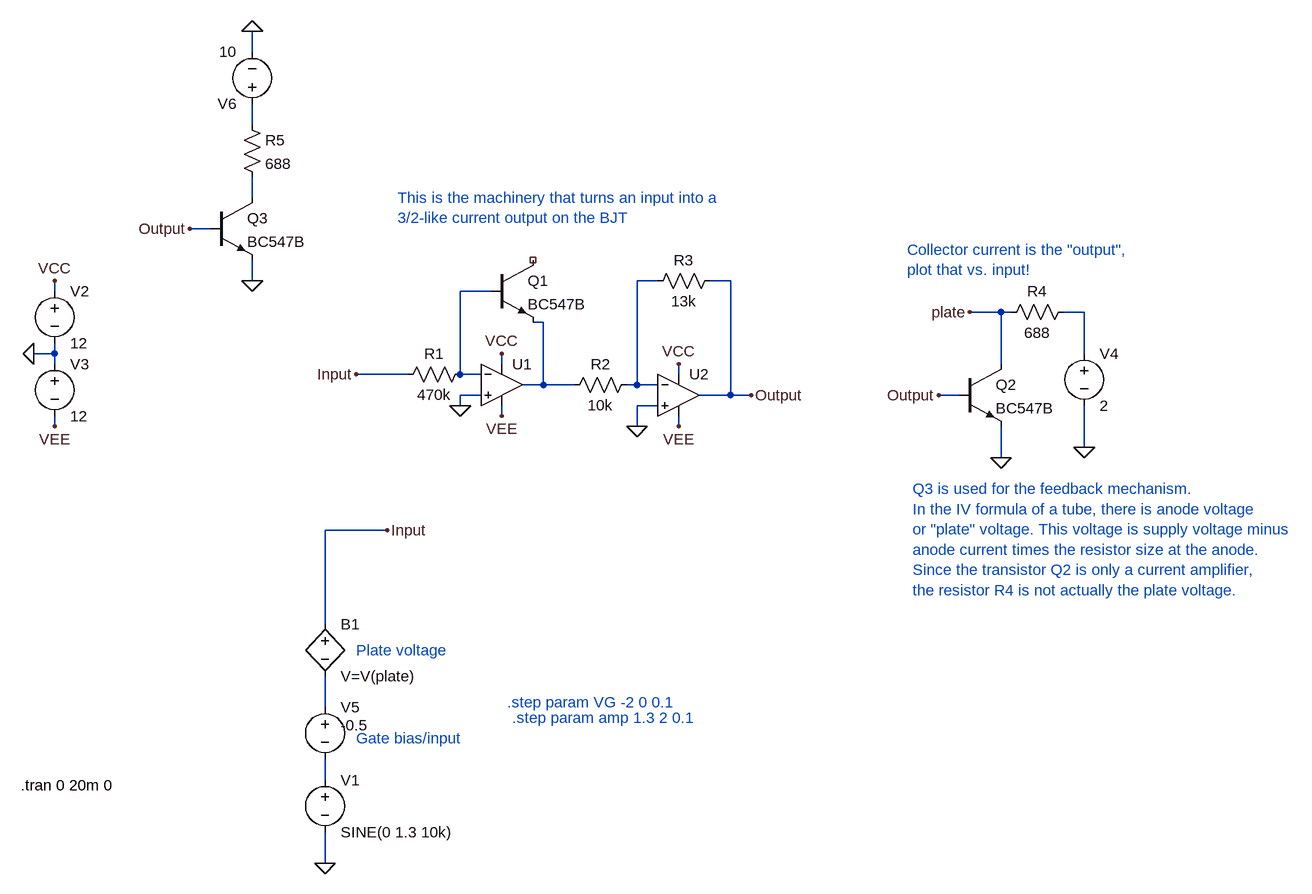
[diagram p0: schematic Amp_test.asc]
Amp_test.asc, the LTspice schematic file:
Version 4
SHEET 1 2184 900
WIRE -192 -368 -192 -400
WIRE -192 -256 -192 -288
WIRE -192 -144 -192 -176
WIRE -256 -96 -288 -96
WIRE -192 -16 -192 -48
WIRE 432 -16 400 -16
WIRE 544 -16 512 -16
WIRE -496 0 -496 -16
WIRE 176 0 128 0
WIRE 960 32 912 32
WIRE 976 32 960 32
WIRE 1088 32 1056 32
WIRE 256 48 240 48
WIRE -496 96 -496 80
WIRE -496 96 -528 96
WIRE 1088 96 1088 32
WIRE -496 112 -496 96
WIRE 192 112 192 96
WIRE 960 112 960 32
WIRE 48 128 -32 128
WIRE 128 128 128 0
WIRE 160 128 128 128
WIRE 464 128 464 112
WIRE 256 144 256 48
WIRE 256 144 224 144
WIRE 304 144 256 144
WIRE 400 144 400 -16
WIRE 400 144 384 144
WIRE 432 144 400 144
WIRE 160 160 128 160
WIRE 544 160 544 -16
WIRE 544 160 496 160
WIRE 576 160 544 160
WIRE 896 160 864 160
WIRE 128 176 128 160
WIRE 432 176 400 176
WIRE 192 192 192 176
WIRE -496 208 -496 192
WIRE 400 208 400 176
WIRE 464 208 464 192
WIRE 1088 240 1088 176
WIRE 960 256 960 208
WIRE 16 368 -80 368
WIRE -80 512 -80 368
WIRE -80 640 -80 592
WIRE -80 752 -80 720
WIRE -80 880 -80 832
FLAG 128 176 0
FLAG -528 96 0
FLAG -496 -16 VCC
FLAG -496 208 VEE
FLAG 192 96 VCC
FLAG 192 192 VEE
FLAG 464 112 VCC
FLAG 464 208 VEE
FLAG 400 208 0
FLAG 1088 240 0
FLAG -80 880 0
FLAG 960 256 0
FLAG 16 368 Input
FLAG -32 128 Input
FLAG 576 160 Output
FLAG 864 160 Output
FLAG -288 -96 Output
FLAG -192 -400 0
FLAG -192 -16 0
FLAG 912 32 plate
SYMBOL res 144 112 R90
WINDOW 0 0 56 VBottom 2
WINDOW 3 32 56 VTop 2
SYMATTR InstName R1
SYMATTR Value 470k
SYMBOL OpAmps\\UniversalOpAmp2 192 144 R0
SYMATTR InstName U1
SYMBOL voltage -496 -16 R0
WINDOW 123 0 0 Left 0
WINDOW 39 0 0 Left 0
SYMATTR InstName V2
SYMATTR Value 12
SYMBOL voltage -496 96 R0
WINDOW 123 0 0 Left 0
WINDOW 39 0 0 Left 0
SYMATTR InstName V3
SYMATTR Value 12
SYMBOL OpAmps\\UniversalOpAmp2 464 160 R0
SYMATTR InstName U2
SYMBOL res 400 128 R90
WINDOW 0 0 56 VBottom 2
WINDOW 3 32 56 VTop 2
SYMATTR InstName R2
SYMATTR Value 10k
SYMBOL res 528 -32 R90
WINDOW 0 0 56 VBottom 2
WINDOW 3 32 56 VTop 2
SYMATTR InstName R3
SYMATTR Value 13k
SYMBOL npn 896 112 R0
SYMATTR InstName Q2
SYMATTR Value BC547B
SYMBOL voltage 1088 80 R0
WINDOW 123 0 0 Left 0
WINDOW 39 0 0 Left 0
SYMATTR InstName V4
SYMATTR Value 2
SYMBOL res 1072 16 R90
WINDOW 0 0 56 VBottom 2
WINDOW 3 32 56 VTop 2
SYMATTR InstName R4
SYMATTR Value 688
SYMBOL npn 176 -48 R0
SYMATTR InstName Q1
SYMATTR Value BC547B
SYMBOL voltage -80 624 R0
WINDOW 123 24 124 Left 2
WINDOW 39 0 0 Left 0
WINDOW 3 24 44 Left 2
SYMATTR Value -0.5
SYMATTR InstName V5
SYMBOL npn -256 -144 R0
SYMATTR InstName Q3
SYMATTR Value BC547B
SYMBOL res -208 -272 R0
SYMATTR InstName R5
SYMATTR Value 688
SYMBOL voltage -192 -272 R180
WINDOW 123 0 0 Left 0
WINDOW 39 0 0 Left 0
SYMATTR InstName V6
SYMATTR Value 10
SYMBOL bv -80 496 R0
SYMATTR InstName B1
SYMATTR Value V=V(plate)
SYMBOL voltage -80 736 R0
WINDOW 123 0 0 Left 0
WINDOW 39 0 0 Left 0
SYMATTR InstName V1
SYMATTR Value SINE(0 1.3 10k)
TEXT 816 -64 Left 2 ;Collector current is the "output",\nplot that vs. input!
TEXT 824 304 Left 2 ;Q3 is used for the feedback mechanism.\nIn the IV formula of a tube, there is anode voltage\nor "plate" voltage. This voltage is supply voltage minus\nanode current times the resistor size at the anode.\nSince the transistor Q2 is only a current amplifier, \nthe resistor R4 is not actually the plate voltage.
TEXT -32 688 Left 2 ;Gate bias/input
TEXT -32 552 Left 2 ;Plate voltage
TEXT 32 -144 Left 2 ;This is the machinery that turns an input into a\n3/2-like current output on the BJT
TEXT -548 760 Left 2 !.tran 0 20m 0
TEXT 200 632 Left 2 ;.step param VG -2 0 0.1
TEXT 208 656 Left 2 ;.step param amp 1.3 2 0.1

The netlist it stands for:
* Amp_test.asc
R1 N004 Input 470k
XU1 0 N004 VCC VEE N006 level2 Avol=1Meg GBW=10Meg Slew=10Meg Ilimit=25m Rail=0 Vos=0 En=0 Enk=0 In=0 Ink=0 Rin=500Meg  ; pins In+ In- V+ V- OUT
V2 VCC 0 12
V3 0 VEE 12
XU2 0 N003 VCC VEE Output level2 Avol=1Meg GBW=10Meg Slew=10Meg Ilimit=25m Rail=0 Vos=0 En=0 Enk=0 In=0 Ink=0 Rin=500Meg  ; pins In+ In- V+ V- OUT
R2 N003 N006 10k
R3 Output N003 13k
Q2 plate Output 0 0 BC547B
V4 N005 0 2
R4 N005 plate 688
Q1 NC_01 N004 N006 0 BC547B
V5 N007 N008 -0.5
Q3 N002 Output 0 0 BC547B
R5 N001 N002 688
V6 N001 0 10
B1 Input N007 V=V(plate)
V1 N008 0 SINE(0 1.3 10k)
.model NPN NPN
.model PNP PNP
.lib standard.bjt
* Collector current is the "output",
* plot that vs. input!
* Q3 is used for the feedback mechanism.
* In the IV formula of a tube, there is anode voltage
* or "plate" voltage. This voltage is supply voltage minus
* anode current times the resistor size at the anode.
* Since the transistor Q2 is only a current amplifier,
* the resistor R4 is not actually the plate voltage.
* Gate bias/input
* Plate voltage
* This is the machinery that turns an input into a
* 3/2-like current output on the BJT
.tran 0 20m 0
* .step param VG -2 0 0.1
* .step param amp 1.3 2 0.1
.lib UniversalOpAmp2.lib
.backanno
.end